# Altium schematic sheet USB Device.SchDoc
size A4
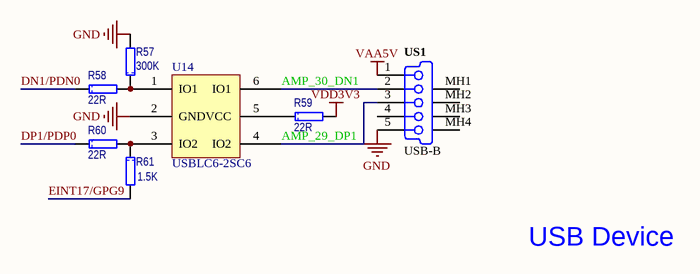
[diagram p0: USB Device.SchDoc]

## Parts
R57  300K  [1608[0603]R]
R58  22R  [1608[0603]R]
R59  22R  [1608[0603]R]
R60  22R  [1608[0603]R]
R61  1.5K  [1608[0603]R]
U14  USBLC6-2SC6  [SOT26A-6N]
US1  USB-B  [USB/SM0.8-6H5]

## Nets
GND: R57.2 U14.2(GND) US1.5
VAA5V: US1.1
VDD3V3: R59.2
AMP_29_DP1: U14.4(IO2) US1.3
AMP_30_DN1: U14.6(IO1) US1.2
DN1/PDN0: R58.1
DP1/PDP0: R60.1
EINT17/GPG9: R61.2
NetR57_1: R57.1 R58.2 U14.1(IO1)
NetR59_1: R59.1 U14.5(VCC)
NetR60_2: R60.2 R61.1 U14.3(IO2)

Not connected (* = marked no-connect by the designer): US1 4 MH1 MH2 MH3 MH4

## Notes on the sheet
- USB Device

## Library data of the parts
R57 = RES: Manufacturer: vishay; Model: RT0603DRD7D300KL; Value: 300K; Type: 无铅电阻
R58-R60 = RES: Manufacturer: vishay; Model: CRCW060322R0KKEDTR; Value: 22R; Type: 无铅电阻
R61 = RES: Manufacturer: vishay; Model: RT0603DRD7D1KL; Value: 1.5K; Type: 无铅电阻
U14 = USBLC6-2SC6: ESD; 公司: ST
US1 = D-300-0034: USB On-The-Go (OTG) Mini-B Receptacle, Right Angle, SMT, 0.80mm (.031") Pitch, Solder Tabs with Back Cover, Recessed Type; Max Current: mA; Connector type: Right Angle; Mounting Technology: Surface Mount; Status: Unreleased; Category: Connector